# EAGLE design tinyg_g2_breakout (EAGLE 7.5.0)
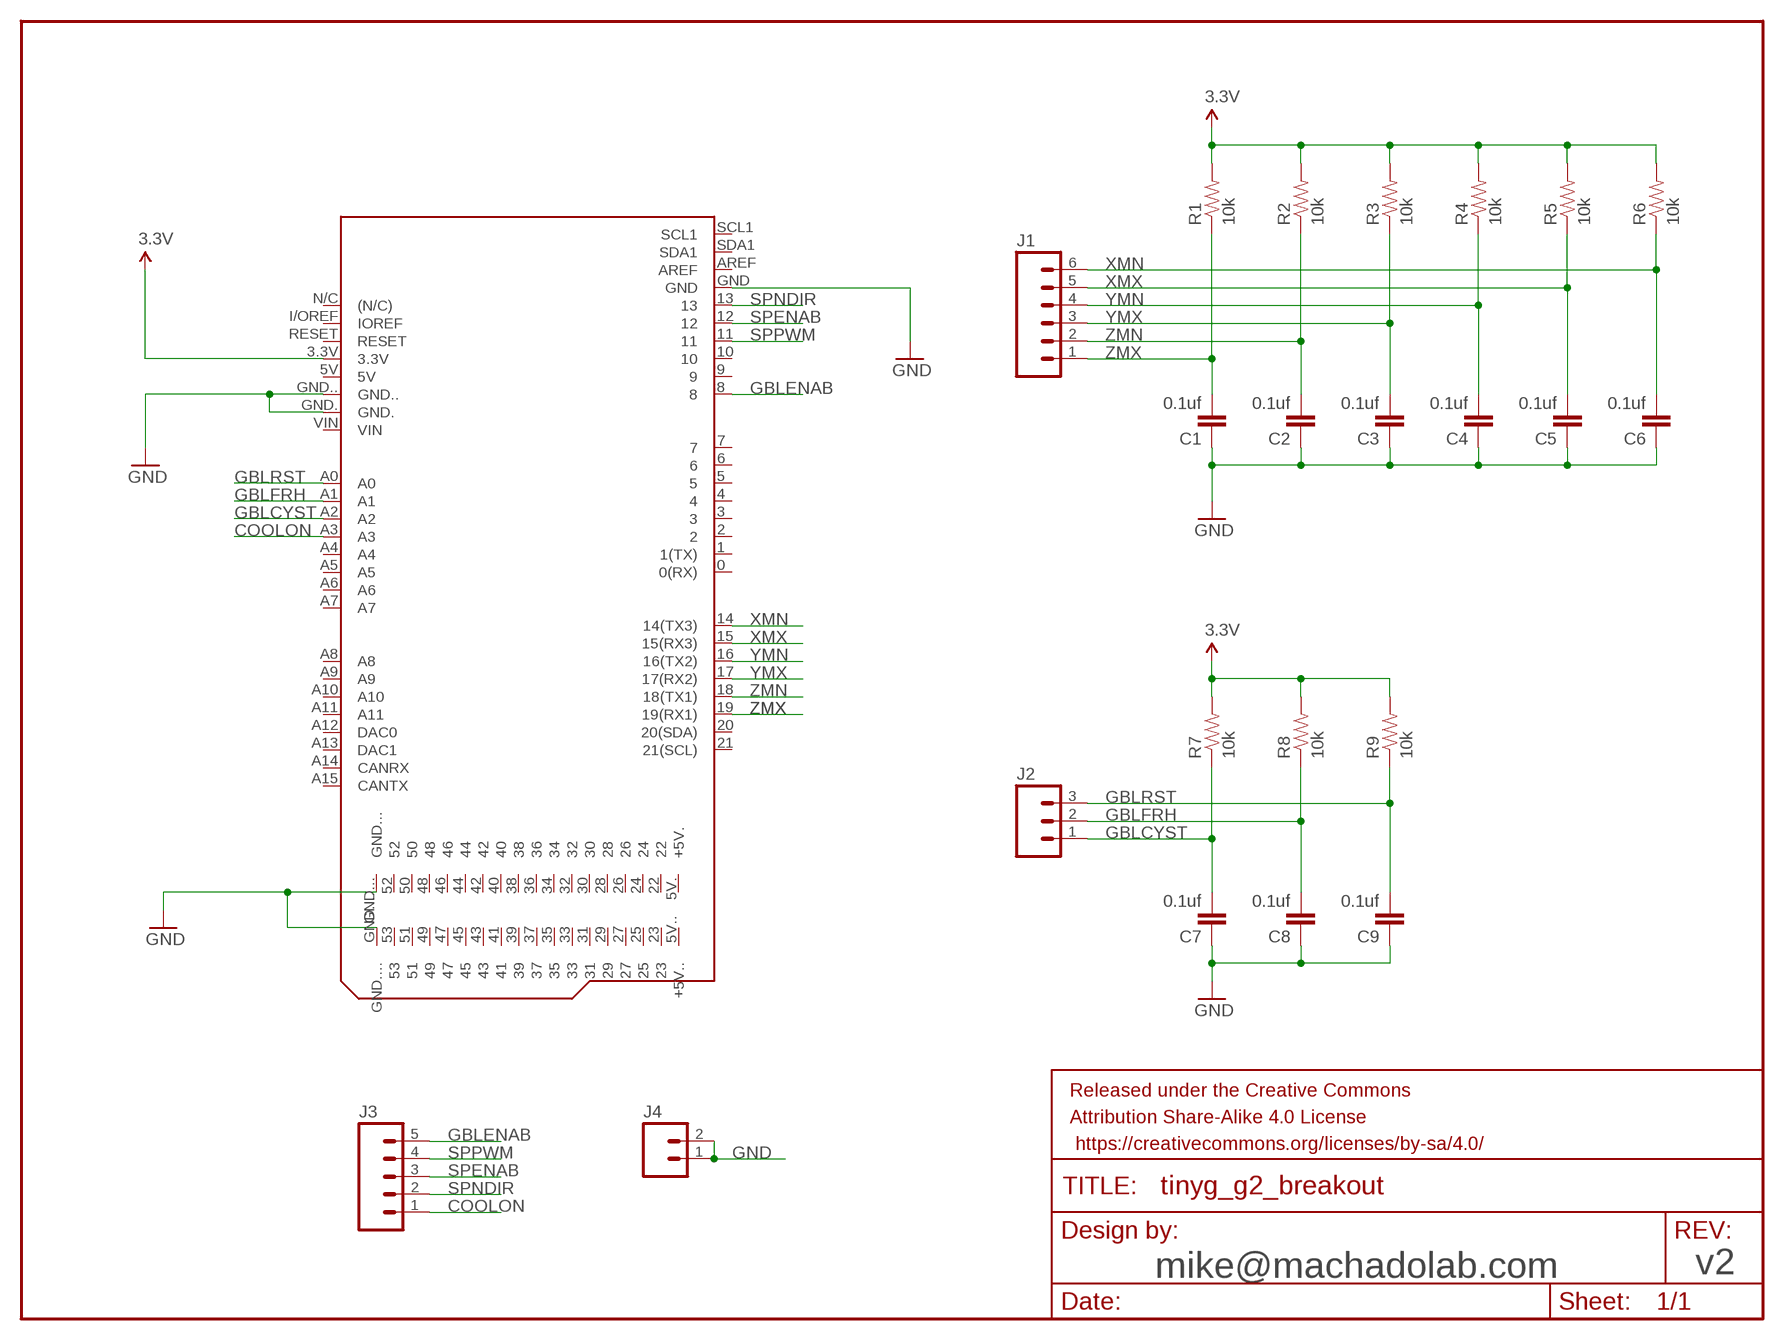
[diagram p0: schematic, sheet 1]

## Parts
C1  0.1uf  CAPPTH  [CAP-PTH-SMALL]
C2  0.1uf  CAPPTH  [CAP-PTH-SMALL]
C3  0.1uf  CAPPTH  [CAP-PTH-SMALL]
C4  0.1uf  CAPPTH  [CAP-PTH-SMALL]
C5  0.1uf  CAPPTH  [CAP-PTH-SMALL]
C6  0.1uf  CAPPTH  [CAP-PTH-SMALL]
C7  0.1uf  CAPPTH  [CAP-PTH-SMALL]
C8  0.1uf  CAPPTH  [CAP-PTH-SMALL]
C9  0.1uf  CAPPTH  [CAP-PTH-SMALL]
FRAME1  v1  FRAME-LETTER  [CREATIVE_COMMONS]
J1  M06SILK_FEMALE_PTH  [1X06]
J2  M03PTH  [1X03]
J3  M05PTH  [1X05]
J4  M02PTH  [1X02]
PCB1  ARDUINO_DUE_SHIELD  [ARDUINO_DUE_SHIELD]
R1  10k  RESISTORAXIAL-0.3  [AXIAL-0.3]
R2  10k  RESISTORAXIAL-0.3  [AXIAL-0.3]
R3  10k  RESISTORAXIAL-0.3  [AXIAL-0.3]
R4  10k  RESISTORAXIAL-0.3  [AXIAL-0.3]
R5  10k  RESISTORAXIAL-0.3  [AXIAL-0.3]
R6  10k  RESISTORAXIAL-0.3  [AXIAL-0.3]
R7  10k  RESISTORAXIAL-0.3  [AXIAL-0.3]
R8  10k  RESISTORAXIAL-0.3  [AXIAL-0.3]
R9  10k  RESISTORAXIAL-0.3  [AXIAL-0.3]

## Nets
3.3V: PCB1.3.3V R1.P$2 R2.P$2 R3.P$2 R4.P$2 R5.P$2 R6.P$2 R7.P$2 R8.P$2 R9.P$2
COOLON: J3.1 PCB1.A3
GBLCYST: C7.2 J2.1 PCB1.A2 R7.P$1
GBLENAB: J3.5 PCB1.8
GBLFRH: C8.2 J2.2 PCB1.A1 R8.P$1
GBLRST: C9.2 J2.3 PCB1.A0 R9.P$1
GND: C1.1 C2.1 C3.1 C4.1 C5.1 C6.1 C7.1 C8.1 C9.1 J4.1 J4.2 PCB1.GND PCB1.GND. PCB1.GND.. PCB1.GND... PCB1.GND....
SPENAB: J3.3 PCB1.12
SPNDIR: J3.2 PCB1.13
SPPWM: J3.4 PCB1.11
XMN: C6.2 J1.6 PCB1.14(14(TX3)) R6.P$1
XMX: C5.2 J1.5 PCB1.15(15(RX3)) R5.P$1
YMN: C4.2 J1.4 PCB1.16(16(TX2)) R4.P$1
YMX: C3.2 J1.3 PCB1.17(17(RX2)) R3.P$1
ZMN: C2.2 J1.2 PCB1.18(18(TX1)) R2.P$1
ZMX: C1.2 J1.1 PCB1.19(19(RX1)) R1.P$1
Unconnected: PCB1.0(0(RX)) PCB1.1(1(TX)) PCB1.2 PCB1.3 PCB1.4 PCB1.5 PCB1.5V PCB1.5V.(+5V.) PCB1.5V..(+5V..) PCB1.6 PCB1.7 PCB1.9 PCB1.10 PCB1.20(20(SDA)) PCB1.21(21(SCL)) PCB1.22 PCB1.23 PCB1.24 PCB1.25 PCB1.26 PCB1.27 PCB1.28 PCB1.29 PCB1.30 PCB1.31 PCB1.32 PCB1.33 PCB1.34 PCB1.35 PCB1.36 PCB1.37 PCB1.38 PCB1.39 PCB1.40 PCB1.41 PCB1.42 PCB1.43 PCB1.44 PCB1.45 PCB1.46 PCB1.47 PCB1.48 PCB1.49 PCB1.50 PCB1.51 PCB1.52 PCB1.53 PCB1.A4 PCB1.A5 PCB1.A6 PCB1.A7 PCB1.A8 PCB1.A9 PCB1.A10 PCB1.A11 PCB1.A12(DAC0) PCB1.A13(DAC1) PCB1.A14(CANRX) PCB1.A15(CANTX) PCB1.AREF PCB1.I/OREF(IOREF) PCB1.N/C((N/C)) PCB1.RESET PCB1.SCL1 PCB1.SDA1 PCB1.VIN

## Notes on the sheet
- mike@machadolab.com | v2

## Library data of the parts
C1-C9 = SparkFun-Passives:CAP: Capacitor Standard 0603 ceramic capacitor, and 0.1" leaded capacitor.
FRAME1 = SparkFun-Aesthetics:FRAME-LETTER: Schematic Frame Standard 8.5x11 US Letter frame
J1 = SparkFun-Connectors:M06: Header 6 Standard 6-pin 0.1" header. Use with straight break away headers (SKU : PRT-00116), right angle break away headers (PRT-00553), swiss pins (PRT-00743), machine pins (PRT-00117), and female headers (PRT-00115). Molex polarized connector foot print use with SKU : PRT-08094 with associated crimp pins and housings. NOTES ON THE VARIANTS LOCK and LOCK_LONGPADS... This footprint was designed to help hold the alignment of a through-hole component (i.e. 6-pin header) while soldering it into place. You may notice that each hole has been shifted either up or down by 0.005 of an inch from it's more standard position (which is a perfectly straight line). This slight alteration caused the pins (the squares in the middle) to touch the edges of the holes. Because they are alternating, it causes a "brace" to hold the component in place. 0.005 has proven to be the perfect amount of "off-center" position when using our standard breakaway headers. Although looks a little odd when you look at the bare footprint, once you have a header in there, the alteration is very hard to notice. Also,if you push a header all the way into place, it is covered up entirely on the bottom side. This idea of altering the position of holes to aid alignment will be further integrated into the Sparkfun Library for other footprints. It can help hold any component with 3 or more connection pins.; PROD_ID: CONN-08437
J2 = SparkFun-Connectors:M03: Header 3 Standard 3-pin 0.1" header. Use with straight break away headers (SKU : PRT-00116), right angle break away headers (PRT-00553), swiss pins (PRT-00743), machine pins (PRT-00117), and female headers (PRT-00115). Molex polarized connector foot print use with SKU : PRT-08232 with associated crimp pins and housings.
J3 = SparkFun-Connectors:M05: Header 5 Standard 5-pin 0.1" header. Use with straight break away headers (SKU : PRT-00116), right angle break away headers (PRT-00553), swiss pins (PRT-00743), machine pins (PRT-00117), and female headers (PRT-00115). Molex polarized connector foot print use with SKU : PRT-08230 with associated crimp pins and housings.
J4 = SparkFun-Connectors:M02: Standard 2-pin 0.1" header. Use with - straight break away headers ( PRT-00116) - right angle break away headers (PRT-00553) - swiss pins (PRT-00743) - machine pins (PRT-00117) - female headers (PRT-00115) Molex polarized connector foot print use with: PRT-08233 with associated crimp pins and housings. 2.54_SCREWTERM for use with PRT-10571. 3.5mm Screw Terminal footprints for PRT-08084 5mm Screw Terminal footprints for use with PRT-08432
PCB1 = machadolab:ARDUINO_DUE_SHIELD: Device for representing an Arduino Due board with a footprint in an EAGLE design. Created by Dave Young for Element14. More EAGLE documentation at: http://www.element14.com/community/community/knode/cadsoft_eagle
R1-R9 = SparkFun-Passives:RESISTOR: Resistor Basic schematic elements and footprints for 0603, 1206, and PTH resistors.

## Board
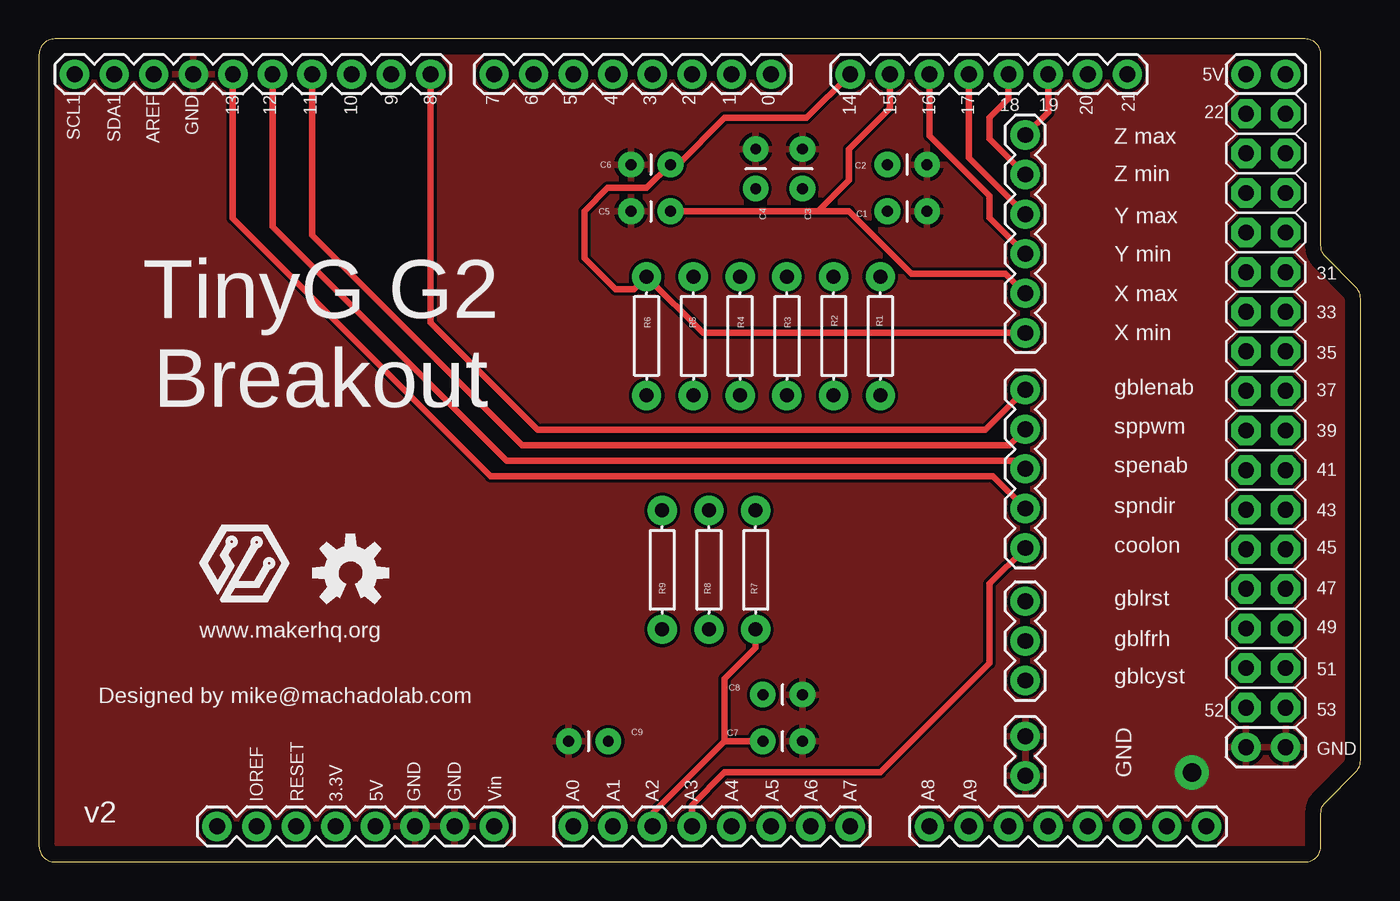
[diagram p1: board, top side]
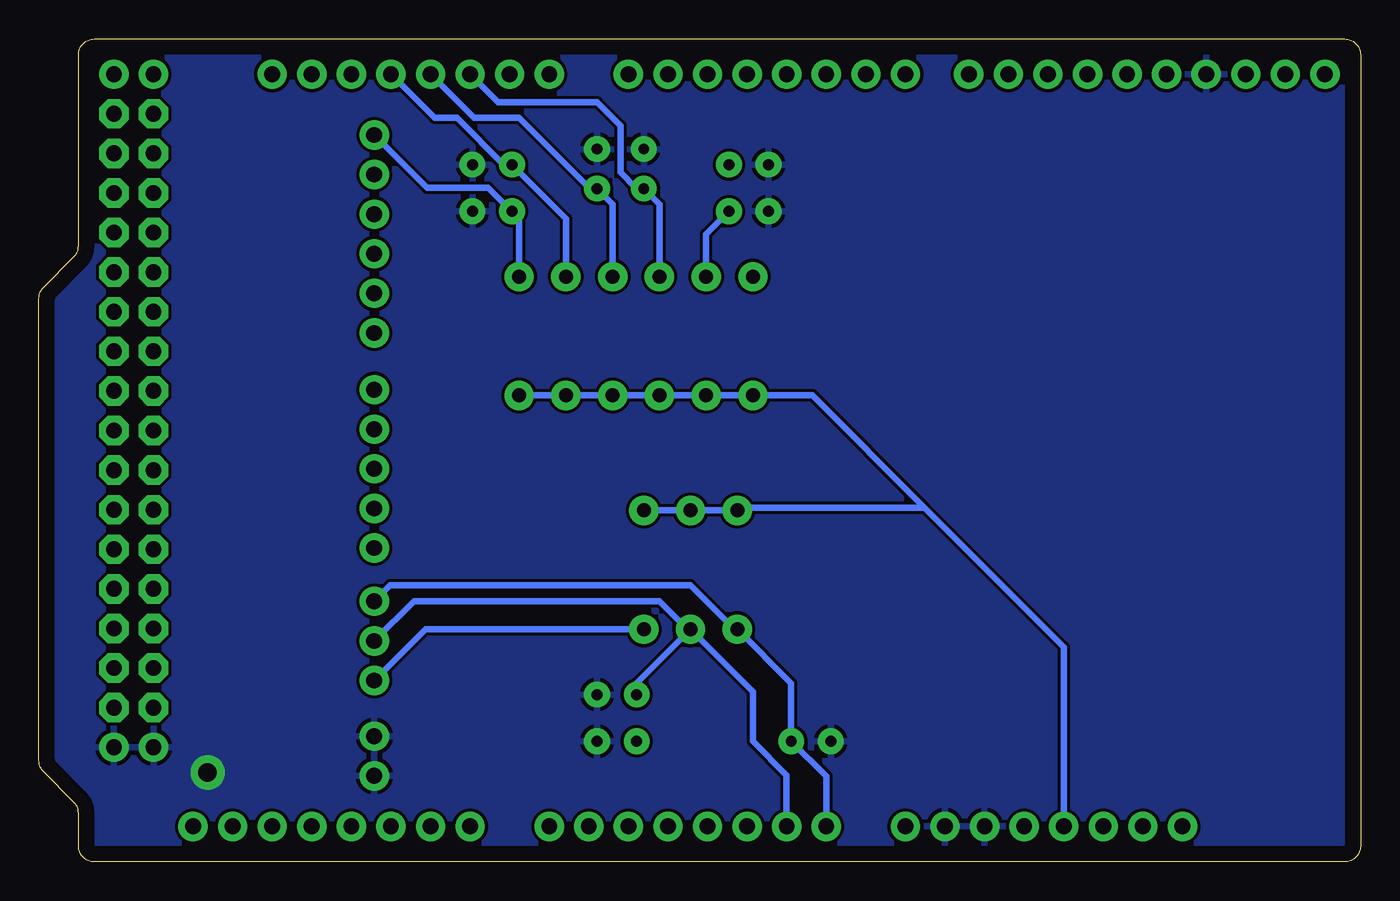
[diagram p2: board, bottom side, seen from below]

Size 84.82 x 52.79 mm. Coordinates in mm from the lower left corner, seen from the top.
Outline: 0,51.79 0,1 arc90 1,0 81.28,0 arc90 82.28,1 82.28,3.13 arc-45 82.57,3.83 84.53,5.79 arc45 84.82,6.49 84.82,36.15 arc45 84.53,36.85 82.57,38.81 arc-45 82.28,39.51 82.28,51.79 arc90 81.28,52.79 1,52.79 arc90 0,51.79
Copper layers (1*16): Top 0.035mm / dielectric 1.5mm / Bottom 0.035mm
Design rules "default *": minimum track width 12mil, minimum drill 24mil, track to track 8mil, track to pad 8mil, pad to pad 8mil, via to via 8mil, smd to smd 8mil, copper to edge 40mil, drill to drill 8mil, minimum pad ring 10mil, minimum via ring 8mil, stop-mask expansion 4mil, vias tented up to drill 0mil, thermal gap 10mil

### Footprints (pad centres in the part's own frame; a part is rotated, then mirrored left to right if it is on the bottom)
CAP-PTH-SMALL = drill 0.7 pad 1.651: 1 0,0; 2 2.54,0
1X06 = drill 1.016 pad 1.88: 1 0,0; 2 2.54,0; 3 5.08,0; 4 7.62,0; 5 10.16,0; 6 12.7,0
1X03 = drill 1.016 pad 1.88: 1 0,0; 2 2.54,0; 3 5.08,0
1X05 = drill 1.016 pad 1.88: 1 0,0; 2 2.54,0; 3 5.08,0; 4 7.62,0; 5 10.16,0
1X02 = drill 1.016 pad 1.88: 1 0,0; 2 2.54,0
ARDUINO_DUE_SHIELD = drill 1.016 pad 1.88: 0 45.72,49.53; 1 43.18,49.53; 2 40.64,49.53; 3 38.1,49.53; 3.3V 17.78,1.27; 4 35.56,49.53; 5 33.02,49.53; 5V 20.32,1.27; 5V. 76.2,49.53; 5V.. 78.74,49.53; 6 30.48,49.53; 7 27.94,49.53; 8 23.876,49.53; 9 21.336,49.53; 10 18.796,49.53; 11 16.256,49.53; 12 13.716,49.53; 13 11.176,49.53; 14 50.8,49.53; 15 53.34,49.53; 16 55.88,49.53; 17 58.42,49.53; 18 60.96,49.53; 19 63.5,49.53; 20 66.04,49.53; 21 68.58,49.53; A0 33.02,1.27; A1 35.56,1.27; A2 38.1,1.27; A3 40.64,1.27; A4 43.18,1.27; A5 45.72,1.27; A6 48.26,1.27; A7 50.8,1.27; A8 55.88,1.27; A9 58.42,1.27; A10 60.96,1.27; A11 63.5,1.27; A12 66.04,1.27; A13 68.58,1.27; A14 71.12,1.27; A15 73.66,1.27; AREF 6.096,49.53; GND 8.636,49.53; GND. 25.4,1.27; GND.. 22.86,1.27; GND... 76.2,6.35; GND.... 78.74,6.35; I/OREF 12.7,1.27; N/C 10.16,1.27; RESET 15.24,1.27; SCL1 1.016,49.53; SDA1 3.556,49.53; VIN 27.94,1.27 | drill 1.016 pad 1.88 octagon: 22 76.2,46.99; 23 78.74,46.99; 24 76.2,44.45; 25 78.74,44.45; 26 76.2,41.91; 27 78.74,41.91; 28 76.2,39.37; 29 78.74,39.37; 30 76.2,36.83; 31 78.74,36.83; 32 76.2,34.29; 33 78.74,34.29; 34 76.2,31.75; 35 78.74,31.75; 36 76.2,29.21; 37 78.74,29.21; 38 76.2,26.67; 39 78.74,26.67; 40 76.2,24.13; 41 78.74,24.13; 42 76.2,21.59; 43 78.74,21.59; 44 76.2,19.05; 45 78.74,19.05; 46 76.2,16.51; 47 78.74,16.51; 48 76.2,13.97; 49 78.74,13.97; 50 76.2,11.43; 51 78.74,11.43; 52 76.2,8.89; 53 78.74,8.89
AXIAL-0.3 = drill 0.9 pad 1.88: P$1 -3.81,0; P$2 3.81,0

### Placement (x,y rotation side)
C1  57,41.73 180 top
C2  57,44.73 180 top
C3  49,45.73 270 top
C4  46,45.73 270 top
C5  38,41.73 0 top
C6  38,44.73 0 top
C7  49,7.73 180 top
C8  49,10.73 180 top
C9  34,7.73 0 top
FRAME1  13,-15.27 0 top  (outside the outline)
J1  63.3,46.63 270 top
J2  63.3,11.63 90 top
J3  63.3,20.13 90 top
J4  63.3,5.51 90 top
PCB1  1.27,1 0 top
R1  54,33.73 270 top
R2  51,33.73 270 top
R3  48,33.73 270 top
R4  45,33.73 270 top
R5  42,33.73 270 top
R6  39,33.73 270 top
R7  46,18.73 90 top
R8  43,18.73 90 top
R9  40,18.73 90 top
U$1  [OSHW-LOGO-M]  20,18.53 0 top
U$2  [MAKERHQ_LOGO_L]  10.3,16.63 0 top

### Tracks (layer width: path | path; a pad name or v marks a point on that pad's centre or on a via)
3.3V
  Bottom 0.406: PCB1.3.3V 19.05,13.78 28,22.73 | 28,22.73 39.81,22.73 | 39.81,22.73 R9.P$2 R8.P$2 R7.P$2 | 39.81,22.73 39.81,22.92 | R1.P$2 R2.P$2 R3.P$2 R4.P$2 R5.P$2 R6.P$2 35.19,29.92 28,22.73
COOLON
  Top 0.406: PCB1.A3 41.91,3.64 44,5.73 54,5.73 61,12.73 61,17.83 J3.1
GBLCYST
  Top 0.406: PCB1.A2 39.37,3.1 44,7.73 | 44,7.73 C7.2 | R7.P$1 46,13.73 44,11.73 44,7.73
  Bottom 0.406: R7.P$1 60.01,14.92 J2.1
GBLENAB
  Top 0.406: PCB1.8 25.15,34.58 32,27.73 60.74,27.73 J3.5
GBLFRH
  Bottom 0.406: PCB1.A1 36.83,5.56 39,7.73 39,10.92 R8.P$1 | C8.2 46.46,11.46 R8.P$1 | R8.P$1 43.19,14.92 45,16.73 60.74,16.73 J2.2
GBLRST
  Bottom 0.406: PCB1.A0 34.29,5.48 C9.2 36.54,11.46 R9.P$1 40.19,14.92 43,17.73 62.28,17.73 J2.3
GND  (via drill 1.2 pad 2.18)
  other vias: 74,5.73
  pour Top: 0,52.73 82,52.73 82,38.73 85,35.73 85,5.73 82,2.73 82,-0.27 0,-0.27
  pour Bottom: 0,52.73 82,52.73 82,38.73 85,35.73 85,5.73 82,2.73 82,-0.27 0,-0.27
SPENAB
  Top 0.406: PCB1.12 14.99,40.74 30,25.73 62.78,25.73 J3.3
SPNDIR
  Top 0.406: PCB1.13 12.45,41.28 29,24.73 61.24,24.73 J3.2
SPPWM
  Top 0.406: PCB1.11 17.53,40.2 31,26.73 62.28,26.73 J3.4
XMN
  Top 0.406: R6.P$1 39,37.73 | PCB1.14 49.27,47.73 44,47.73 41,44.73 C6.2 40.5,44.73 39,43.23 36.5,43.23 35,41.73 35,38.73 37,36.73 38.19,36.73 R6.P$1 | J1.6 42.61,33.93 R6.P$1
XMX
  Top 0.406: C5.2 50,41.73 | 50,41.73 52,41.73 56,37.73 62.04,37.73 J1.5 | PCB1.15 54.61,48.34 52,45.73 52,43.73 50,41.73
  Bottom 0.406: R5.P$1 42,40.27 C5.2
YMN
  Top 0.406: PCB1.16 57.15,46.58 61,42.73 61,41.31 J1.4
  Bottom 0.406: R4.P$1 45,42.19 C4.2 46.46,43.19 47.5,44.23 47.5,47.23 49,48.73 55.35,48.73 PCB1.16
YMX
  Top 0.406: PCB1.17 59.69,45.16 J1.3
  Bottom 0.406: R3.P$1 48,42.19 C3.2 49.46,43.19 54,47.73 56.89,47.73 PCB1.17
ZMN
  Top 0.406: PCB1.18 62.23,48.96 61,47.73 61,46.39 J1.2
  Bottom 0.406: R2.P$1 51,41.27 C2.2 55,44.73 58,47.73 59.43,47.73 PCB1.18
ZMX
  Top 0.406: PCB1.19 64.77,48.1 J1.1
  Bottom 0.406: R1.P$1 54,41.27 C1.2 54.5,41.73 56,43.23 59.9,43.23 J1.1

### Text on the board
tPlace: 21 | 5V | SCL1 | SDA1 | AREF | GND | 13 | 12 | 11 | 10 | 9 | 8 | 7 | 6 | 5 | 4 | 3 | 2 | 1 | 0 | 14 | 15 | 16 | 17 | 18 | 19 | 20 | 22 | Z max | Z min | Y max | Y min | 31 | X max | 33 | X min | TinyG G2 / Breakout | 35 | gblenab | 37 | sppwm | 39 | spenab | 41 | spndir | 43 | coolon | 45 | gblrst | 47 | 49 | www.makerhq.org | gblfrh | gblcyst | 51 | Designed by mike@machadolab.com | 52 | 53 | GND | GND | IOREF | RESET | 3.3V | 5V | GND | GND | Vin | A0 | A1 | A2 | A3 | A4 | A5 | A6 | A7 | A8 | A9 | v2
tValues: mike@machadolab.com